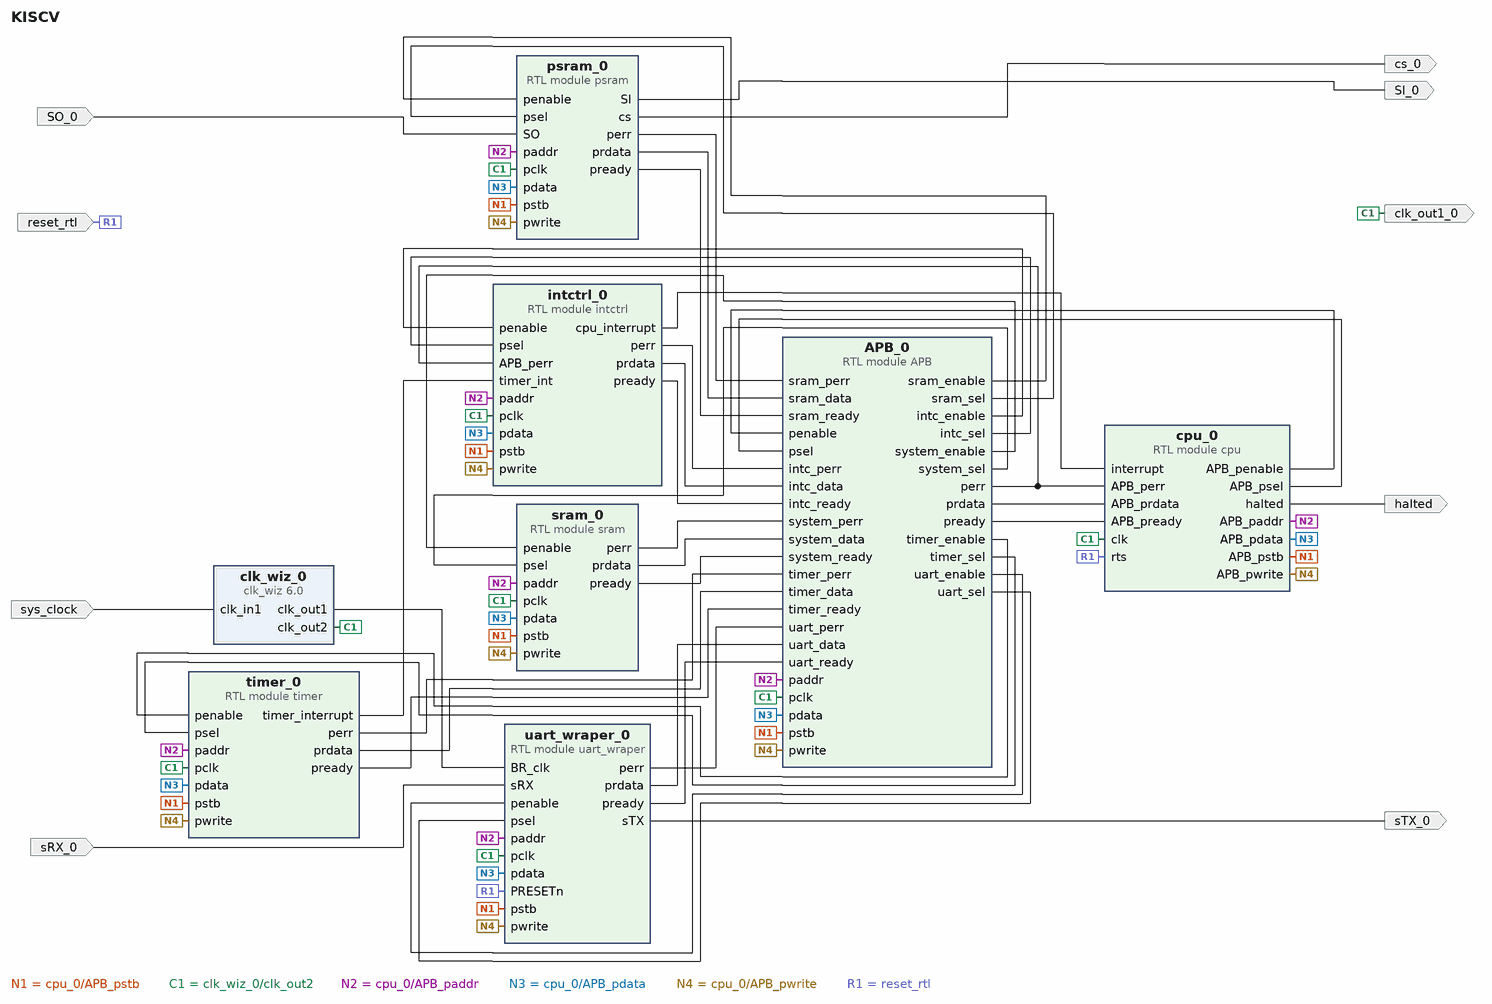
[diagram p0: block diagram of the top level]
# Vivado block design KISCV, xc7z020clg400-1, Vivado 2022.2
create_bd_design KISCV

create_bd_port -dir I -type clk sys_clock
set_property -dict {CONFIG.FREQ_HZ 125000000 CONFIG.PHASE 0.0} [get_bd_ports sys_clock]
create_bd_port -dir I -type rst reset_rtl
set_property -dict {CONFIG.POLARITY ACTIVE_HIGH} [get_bd_ports reset_rtl]
create_bd_port -dir O halted
create_bd_port -dir I sRX_0
create_bd_port -dir O sTX_0
create_bd_port -dir O SI_0
create_bd_port -dir O cs_0
create_bd_port -dir I SO_0
create_bd_port -dir O -type clk clk_out1_0

create_bd_cell -type ip -vlnv xilinx.com:ip:clk_wiz:6.0 clk_wiz_0
set_property -dict [list \
  CONFIG.CLKOUT1_JITTER 555.644 \
  CONFIG.CLKOUT1_PHASE_ERROR 494.034 \
  CONFIG.CLKOUT1_REQUESTED_OUT_FREQ 14.745 \
  CONFIG.CLKOUT1_USED true \
  CONFIG.CLKOUT2_JITTER 615.877 \
  CONFIG.CLKOUT2_PHASE_ERROR 494.034 \
  CONFIG.CLKOUT2_REQUESTED_OUT_FREQ 7.3725 \
  CONFIG.CLKOUT2_USED true \
  CONFIG.CLK_IN1_BOARD_INTERFACE sys_clock \
  CONFIG.MMCM_CLKFBOUT_MULT_F 51.500 \
  CONFIG.MMCM_CLKIN2_PERIOD 10.0 \
  CONFIG.MMCM_CLKOUT0_DIVIDE_F 48.500 \
  CONFIG.MMCM_CLKOUT1_DIVIDE 97 \
  CONFIG.MMCM_DIVCLK_DIVIDE 9 \
  CONFIG.NUM_OUT_CLKS 2 \
  CONFIG.USE_BOARD_FLOW true \
  CONFIG.USE_LOCKED false \
  CONFIG.USE_RESET false \
] [get_bd_cells clk_wiz_0]
create_bd_cell -type module -reference cpu cpu_0
create_bd_cell -type module -reference APB APB_0
create_bd_cell -type module -reference intctrl intctrl_0
create_bd_cell -type module -reference timer timer_0
create_bd_cell -type module -reference sram sram_0
set_property -dict {CONFIG.FILE system.mem CONFIG.RAM_SIZE 1000} [get_bd_cells sram_0]
create_bd_cell -type module -reference psram psram_0
create_bd_cell -type module -reference uart_wraper uart_wraper_0

# ---- connections ----

connect_bd_net [get_bd_pins APB_0/intc_enable] [get_bd_pins intctrl_0/penable]
connect_bd_net [get_bd_pins APB_0/intc_sel] [get_bd_pins intctrl_0/psel]
connect_bd_net [get_bd_pins APB_0/perr] [get_bd_pins cpu_0/APB_perr] [get_bd_pins intctrl_0/APB_perr]
connect_bd_net [get_bd_pins APB_0/prdata] [get_bd_pins cpu_0/APB_prdata]
connect_bd_net [get_bd_pins APB_0/pready] [get_bd_pins cpu_0/APB_pready]
connect_bd_net [get_bd_pins APB_0/sram_enable] [get_bd_pins psram_0/penable]
connect_bd_net [get_bd_pins APB_0/sram_sel] [get_bd_pins psram_0/psel]
connect_bd_net [get_bd_pins APB_0/system_enable] [get_bd_pins sram_0/penable]
connect_bd_net [get_bd_pins APB_0/system_sel] [get_bd_pins sram_0/psel]
connect_bd_net [get_bd_pins APB_0/timer_enable] [get_bd_pins timer_0/penable]
connect_bd_net [get_bd_pins APB_0/timer_sel] [get_bd_pins timer_0/psel]
connect_bd_net [get_bd_pins APB_0/uart_enable] [get_bd_pins uart_wraper_0/penable]
connect_bd_net [get_bd_pins APB_0/uart_sel] [get_bd_pins uart_wraper_0/psel]
connect_bd_net [get_bd_pins cpu_0/APB_pstb] \
  [get_bd_pins APB_0/pstb] [get_bd_pins intctrl_0/pstb] [get_bd_pins timer_0/pstb] [get_bd_pins sram_0/pstb] \
  [get_bd_pins psram_0/pstb] [get_bd_pins uart_wraper_0/pstb]
connect_bd_net -net SO_0_1 [get_bd_ports SO_0] [get_bd_pins psram_0/SO]
connect_bd_net [get_bd_pins clk_wiz_0/clk_out2] \
  [get_bd_ports clk_out1_0] [get_bd_pins cpu_0/clk] [get_bd_pins timer_0/pclk] [get_bd_pins sram_0/pclk] \
  [get_bd_pins APB_0/pclk] [get_bd_pins intctrl_0/pclk] [get_bd_pins psram_0/pclk] [get_bd_pins uart_wraper_0/pclk]
connect_bd_net [get_bd_pins clk_wiz_0/clk_out1] [get_bd_pins uart_wraper_0/BR_clk]
connect_bd_net [get_bd_pins cpu_0/APB_paddr] \
  [get_bd_pins APB_0/paddr] [get_bd_pins intctrl_0/paddr] [get_bd_pins timer_0/paddr] [get_bd_pins sram_0/paddr] \
  [get_bd_pins psram_0/paddr] [get_bd_pins uart_wraper_0/paddr]
connect_bd_net [get_bd_pins cpu_0/APB_pdata] \
  [get_bd_pins APB_0/pdata] [get_bd_pins intctrl_0/pdata] [get_bd_pins timer_0/pdata] [get_bd_pins sram_0/pdata] \
  [get_bd_pins psram_0/pdata] [get_bd_pins uart_wraper_0/pdata]
connect_bd_net [get_bd_pins cpu_0/APB_penable] [get_bd_pins APB_0/penable]
connect_bd_net [get_bd_pins cpu_0/APB_psel] [get_bd_pins APB_0/psel]
connect_bd_net [get_bd_pins cpu_0/APB_pwrite] \
  [get_bd_pins APB_0/pwrite] [get_bd_pins intctrl_0/pwrite] [get_bd_pins timer_0/pwrite] [get_bd_pins sram_0/pwrite] \
  [get_bd_pins psram_0/pwrite] [get_bd_pins uart_wraper_0/pwrite]
connect_bd_net [get_bd_pins cpu_0/halted] [get_bd_ports halted]
connect_bd_net [get_bd_pins intctrl_0/cpu_interrupt] [get_bd_pins cpu_0/interrupt]
connect_bd_net [get_bd_pins intctrl_0/perr] [get_bd_pins APB_0/intc_perr]
connect_bd_net [get_bd_pins intctrl_0/prdata] [get_bd_pins APB_0/intc_data]
connect_bd_net [get_bd_pins intctrl_0/pready] [get_bd_pins APB_0/intc_ready]
connect_bd_net [get_bd_pins psram_0/SI] [get_bd_ports SI_0]
connect_bd_net [get_bd_pins psram_0/cs] [get_bd_ports cs_0]
connect_bd_net [get_bd_pins psram_0/perr] [get_bd_pins APB_0/sram_perr]
connect_bd_net [get_bd_pins psram_0/prdata] [get_bd_pins APB_0/sram_data]
connect_bd_net [get_bd_pins psram_0/pready] [get_bd_pins APB_0/sram_ready]
connect_bd_net [get_bd_ports reset_rtl] [get_bd_pins cpu_0/rts] [get_bd_pins uart_wraper_0/PRESETn]
connect_bd_net -net sRX_0_1 [get_bd_ports sRX_0] [get_bd_pins uart_wraper_0/sRX]
connect_bd_net [get_bd_pins sram_0/perr] [get_bd_pins APB_0/system_perr]
connect_bd_net [get_bd_pins sram_0/prdata] [get_bd_pins APB_0/system_data]
connect_bd_net [get_bd_pins sram_0/pready] [get_bd_pins APB_0/system_ready]
connect_bd_net [get_bd_ports sys_clock] [get_bd_pins clk_wiz_0/clk_in1]
connect_bd_net [get_bd_pins timer_0/perr] [get_bd_pins APB_0/timer_perr]
connect_bd_net [get_bd_pins timer_0/prdata] [get_bd_pins APB_0/timer_data]
connect_bd_net [get_bd_pins timer_0/pready] [get_bd_pins APB_0/timer_ready]
connect_bd_net [get_bd_pins timer_0/timer_interrupt] [get_bd_pins intctrl_0/timer_int]
connect_bd_net [get_bd_pins uart_wraper_0/perr] [get_bd_pins APB_0/uart_perr]
connect_bd_net [get_bd_pins uart_wraper_0/prdata] [get_bd_pins APB_0/uart_data]
connect_bd_net [get_bd_pins uart_wraper_0/pready] [get_bd_pins APB_0/uart_ready]
connect_bd_net [get_bd_pins uart_wraper_0/sTX] [get_bd_ports sTX_0]

validate_bd_design
save_bd_design
